# EAGLE design weatherstation (EAGLE 9.5.1)
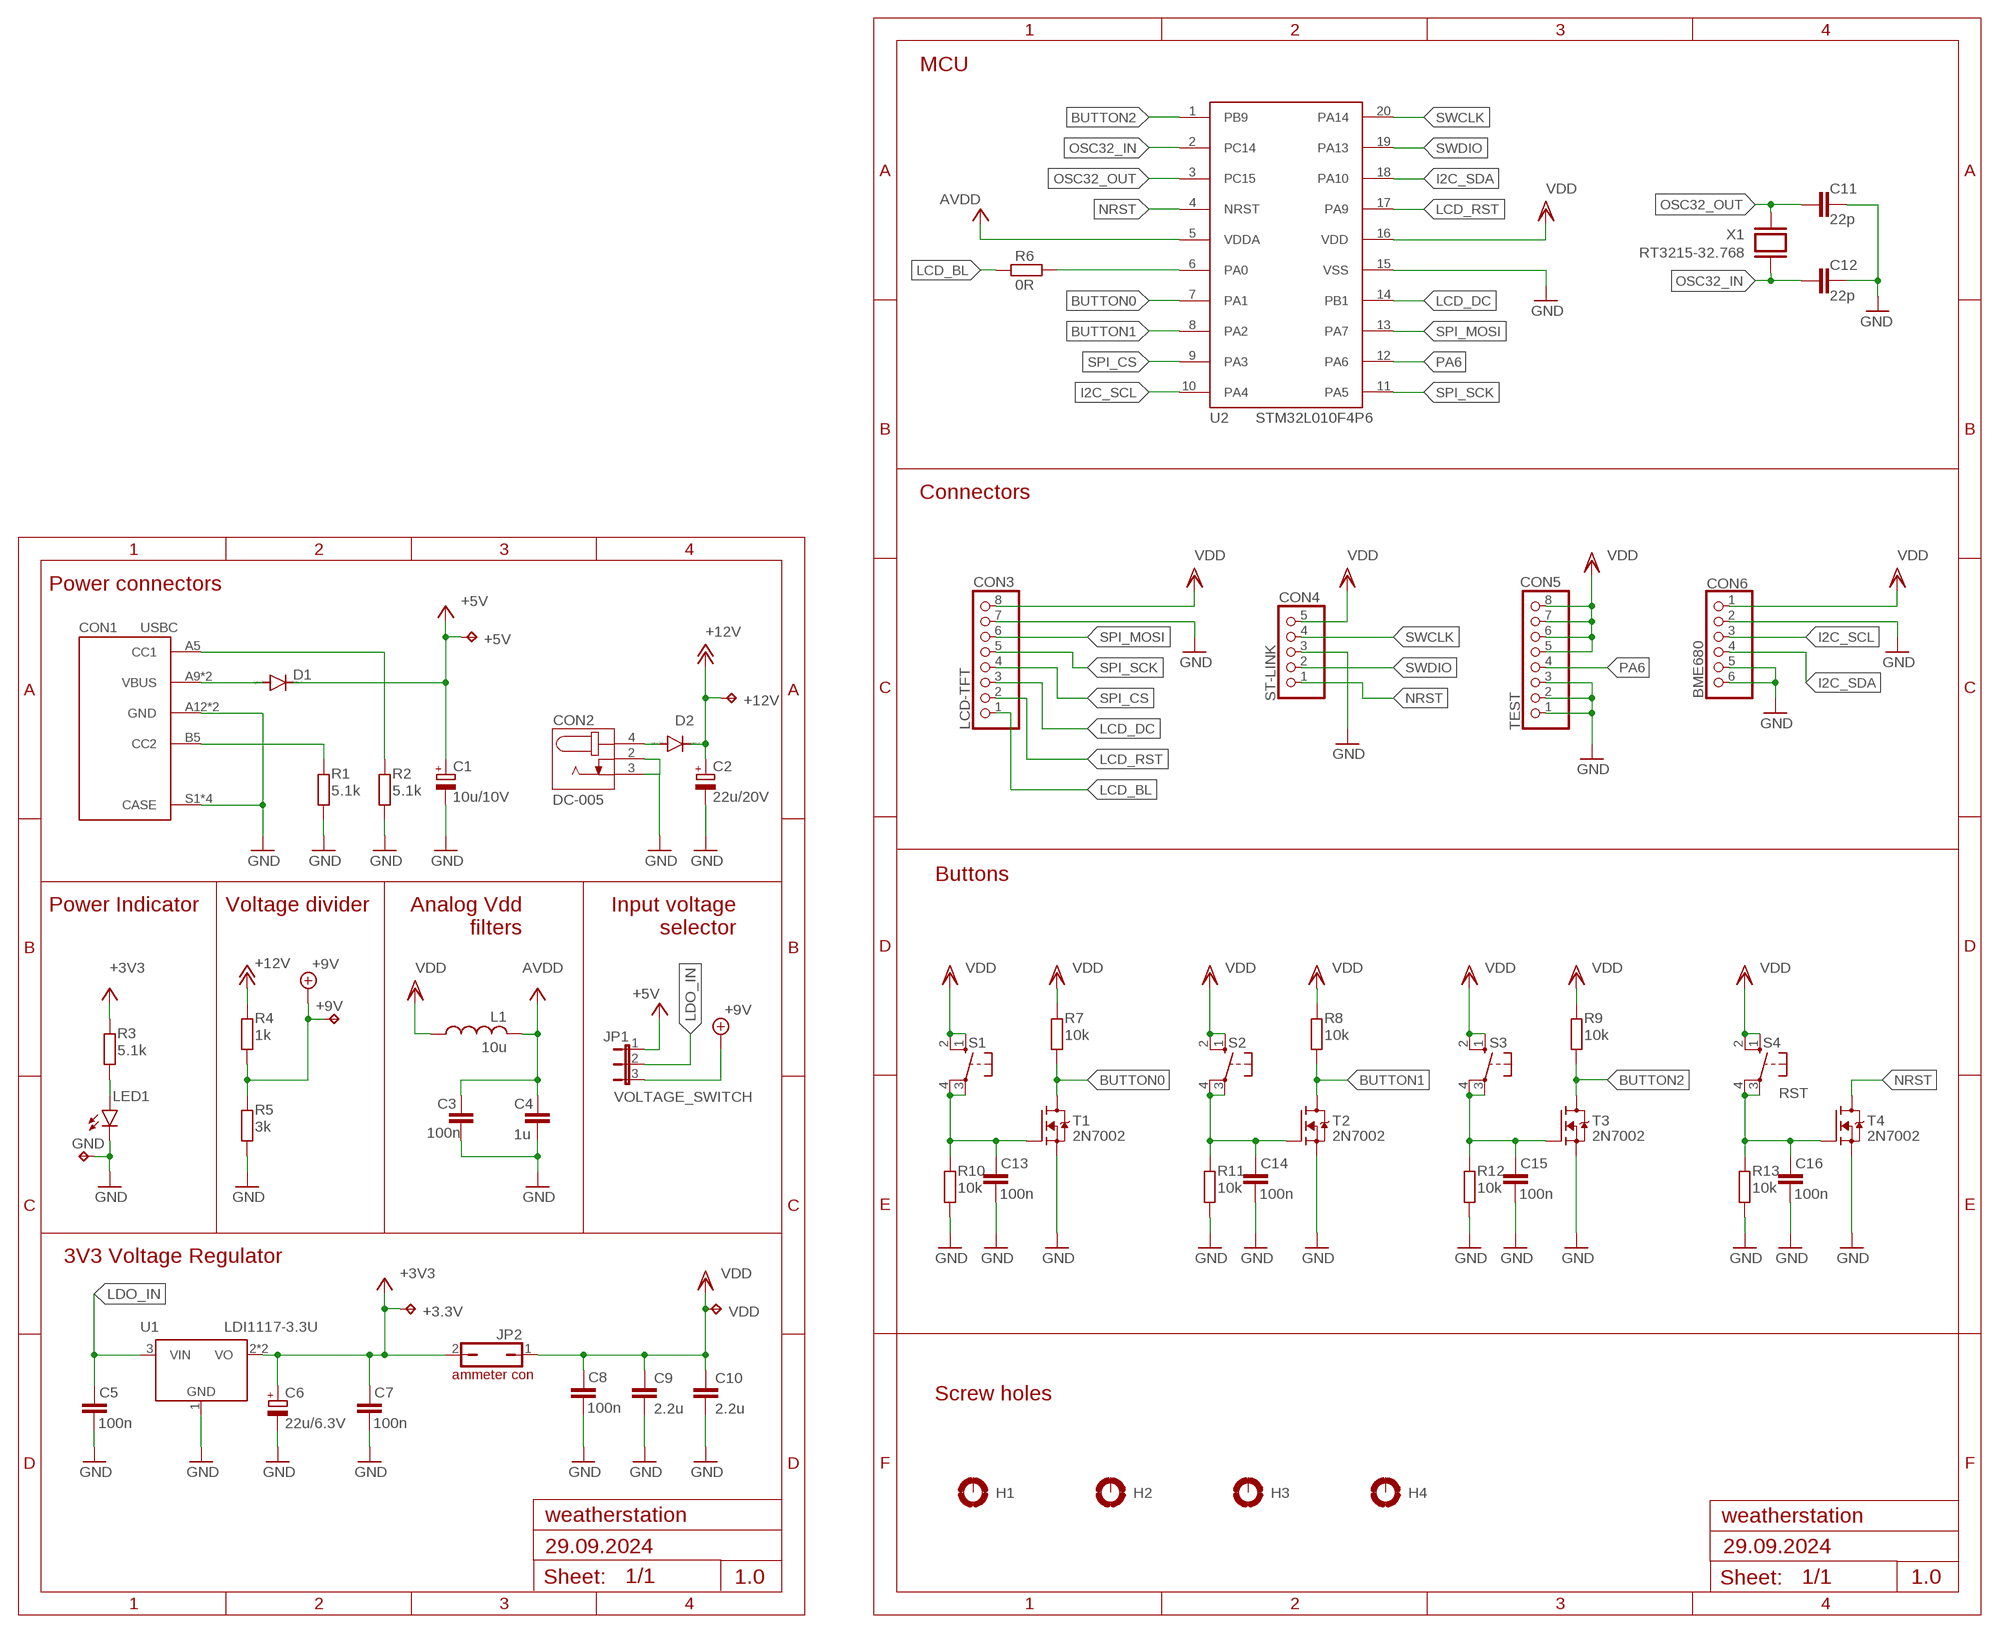
[diagram p0: schematic, sheet 1]

## Parts
+3.3V  TPPAD1-13  [P1-13]
+5V  TPPAD1-13  [P1-13]
+9V  TPPAD1-13  [P1-13]
+12V  TPPAD1-13  [P1-13]
C1  10u/10V  CPOL-EUA/3216-18R  [A/3216-18R]
C2  22u/20V  CPOL-EUC/6032-28R  [C/6032-28R]
C3  100n  C-EUC0603K  [C0603K]
C4  1u  C-EUC0603K  [C0603K]
C5  100n  C-EUC0603K  [C0603K]
C6  22u/6.3V  CPOL-EUA/3216-18R  [A/3216-18R]
C7  100n  C-EUC0603K  [C0603K]
C8  100n  C-EUC0603K  [C0603K]
C9  2.2u  C-EUC0805  [C0805]
C10  2.2u  C-EUC0805  [C0805]
C11  22p  C-EUC0603K  [C0603K]
C12  22p  C-EUC0603K  [C0603K]
C13  100n  C-EUC0603K  [C0603K]
C14  100n  C-EUC0603K  [C0603K]
C15  100n  C-EUC0603K  [C0603K]
C16  100n  C-EUC0603K  [C0603K]
CON1  USBC  [CUI_UJC-HP-3-SMT-TR]
CON2  DC-005  [NINIGI_DC-005]
CON3  LCD-TFT  [LCD]
CON4  ST-LINK  PINHD-1X5  [1X05]
CON5  TEST  PINHD-1X8  [1X08]
CON6  BME680  [BME680]
D1  CGRM4001-G  [SOD-123_MINI-SMA]
D2  ES2D  [SMB]
GND  TPPAD1-13  [P1-13]
H1  MOUNT-PAD-ROUND2.8  [2,8-PAD]
H2  MOUNT-PAD-ROUND2.8  [2,8-PAD]
H3  MOUNT-PAD-ROUND2.8  [2,8-PAD]
H4  MOUNT-PAD-ROUND2.8  [2,8-PAD]
JP1  VOLTAGE_SWITCH  [JP2]
JP2  JP1Q  [JP1]
L1  10u  L-USL2012C  [L2012C]
LED1  LEDCHIPLED_1206  [CHIPLED_1206]
R1  5.1k  R-EU_R0805  [R0805]
R2  5.1k  R-EU_R0805  [R0805]
R3  5.1k  R-EU_R0805  [R0805]
R4  1k  R-EU_R0805  [R0805]
R5  3k  R-EU_R0805  [R0805]
R6  0R  R-EU_R0805  [R0805]
R7  10k  R-EU_R0805  [R0805]
R8  10k  R-EU_R0805  [R0805]
R9  10k  R-EU_R0805  [R0805]
R10  10k  R-EU_R0805  [R0805]
R11  10k  R-EU_R0805  [R0805]
R12  10k  R-EU_R0805  [R0805]
R13  10k  R-EU_R0805  [R0805]
S1  BUTTON0  10-XX  [B3F-10XX]
S2  BUTTON1  10-XX  [B3F-10XX]
S3  BUTTON2  10-XX  [B3F-10XX]
S4  RST  10-XX  [B3F-10XX]
T1  2N7002  [SOT95P240X111-3N]
T2  2N7002  [SOT95P240X111-3N]
T3  2N7002  [SOT95P240X111-3N]
T4  2N7002  [SOT95P240X111-3N]
U1  LDI1117-3.3U  [SOT89]
U2  STM32L010F4P6  [TSSOP20]
VDD  TPPAD1-13  [P1-13]
X1  RT3215-32.768  [XTAL_RT3215-32.768-12.5-TR]

## Nets
+3V3: +3.3V.TP C6.+ C7.1 JP2.2 R3.2 U1.2(VO) U1.2@1(VO)
+5V: +5V.TP C1.+ D1.C JP1.1
+9V: +9V.TP JP1.3 R4.2 R5.1
+12V: +12V.TP C2.+ D2.C R4.1
BUTTON0: R7.1 T1.3(D) U2.7(PA1)
BUTTON1: R8.1 T2.3(D) U2.8(PA2)
BUTTON2: R9.1 T3.3(D) U2.1(PB9)
GND: C1.- C2.- C3.1 C4.2 C5.2 C6.- C7.2 C8.2 C9.2 C10.2 C11.1 C12.1 C13.2 C14.2 C15.2 C16.2 CON1.A12(GND) CON1.B12(GND) CON1.S1(CASE) CON1.S2(CASE) CON1.S3(CASE) CON1.S4(CASE) CON2.2 CON2.3 CON3.7(GND) CON4.3 CON5.1 CON5.2 CON5.3 CON6.2(GND) CON6.5(SDO) CON6.6(CS) GND.TP LED1.C R1.2 R2.1 R5.2 R10.1 R11.1 R12.1 R13.1 T1.2(S) T2.2(S) T3.2(S) T4.2(S) U1.1(GND) U2.15(VSS)
I2C_SCL: CON6.3(SCL) U2.10(PA4)
I2C_SDA: CON6.4(SDA) U2.18(PA10)
LCD_BL: CON3.1(BL) R6.1
LCD_DC: CON3.3(DC) U2.14(PB1)
LCD_RST: CON3.2(RST) U2.17(PA9)
LDO_IN: C5.1 JP1.2 U1.3(VIN)
N$1: LED1.A R3.1
N$2: C16.1 R13.2 S4.3(P) S4.4(P1) T4.1(G)
N$3: CON1.B5(CC2) R1.1
N$4: C13.1 R10.2 S1.3(P) S1.4(P1) T1.1(G)
N$5: CON1.A5(CC1) R2.2
N$6: C14.1 R11.2 S2.3(P) S2.4(P1) T2.1(G)
N$7: R6.2 U2.6(PA0)
N$8: C15.1 R12.2 S3.3(P) S3.4(P1) T3.1(G)
N$9: CON1.A9(VBUS) CON1.B9(VBUS) D1.A
N$10: CON2.4 D2.A
NRST: CON4.1 T4.3(D) U2.4(NRST)
OSC32_IN: C12.2 U2.2(PC14) X1.2
OSC32_OUT: C11.2 U2.3(PC15) X1.1
PA6: CON5.4 U2.12(PA6)
SPI_CS: CON3.4(CS) U2.9(PA3)
SPI_MOSI: CON3.6(DIN) U2.13(PA7)
SPI_SCK: CON3.5(CLK) U2.11(PA5)
SWCLK: CON4.4 U2.20(PA14)
SWDIO: CON4.2 U2.19(PA13)
VCC: C3.2 C4.1 L1.2 U2.5(VDDA) ; supply symbol labelled AVDD
VDD: C8.1 C9.1 C10.1 CON3.8(VCC) CON4.5 CON5.5 CON5.6 CON5.7 CON5.8 CON6.1(VCC) JP2.1 L1.1 R7.2 R8.2 R9.2 S1.1(S) S1.2(S1) S2.1(S) S2.2(S1) S3.1(S) S3.2(S1) S4.1(S) S4.2(S1) U2.16(VDD) VDD.TP
Unconnected: H1.B2,8(MOUNT) H2.B2,8(MOUNT) H3.B2,8(MOUNT) H4.B2,8(MOUNT)

## Notes on the sheet
- MCU
- Connectors
- Power connectors
- Buttons
- Voltage divider
- Analog Vdd
  filters
- Input voltage
  selector
- Power Indicator
- 3V3 Voltage Regulator
- ammeter con
- Screw holes
- 29.09.2024 | 29.09.2024
- 1.0 | 1.0

## Library data of the parts
+3.3V +5V +9V +12V GND VDD = testpad:TP: Test pad
C1 C2 C6 = rcl:CPOL-EU: POLARIZED CAPACITOR, European symbol; SPICEPREFIX: C
C3-C5 C7-C16 = rcl:C-EU: CAPACITOR, European symbol; SPICEPREFIX: C
CON1 = WeatherStation:USBC
CON2 = DC-005:DC-005: DC Jack Check availability <https://pricing.snapeda.com/parts/DC-005/Best%20Inc./view-part?ref=eda>; AVAILABILITY: Not in stock; CHECK_PRICES: https://www.snapeda.com/parts/DC-005/Best+Inc./view-part/?ref=eda; DESCRIPTION: 6.4x14.2x9.0mm Power DC Receptacle; MF: Best Inc.; MP: DC-005; PACKAGE: DC Power Jack Best Inc.; PRICE: None; SNAPEDA_LINK: https://www.snapeda.com/parts/DC-005/Best+Inc./view-part/?ref=snap
CON3 = WeatherStation:LCD-TFT
CON4 = pinhead:PINHD-1X5: PIN HEADER
CON5 = pinhead:PINHD-1X8: PIN HEADER
CON6 = WeatherStation:BME680
D1 = diode:CGRM400*-G: Molded plasitc,JEDEC SOD-123/Mini SMA Source: Comchip CGRM4001-G.pdf
D2 = diode:ES2D: DIODE super fast rectifier, 2 A
H1-H4 = holes:MOUNT-PAD-ROUND: MOUNTING PAD, round
JP1 = WeatherStation:VOLTAGE_SWITCH
JP2 = jumper:JP1Q: JUMPER
L1 = rcl:L-US: INDUCTOR, American symbol; SPICEPREFIX: L
LED1 = led:LED: LED OSRAM: - CHIPLED LG R971, LG N971, LY N971, LG Q971, LY Q971, LO R971, LY R971 LH N974, LH R974 LS Q976, LO Q976, LY Q976 LO Q996 - Hyper CHIPLED LW Q18S LB Q993, LB Q99A, LB R99A - SideLED LS A670, LO A670, LY A670, LG A670, LP A670 LB A673, LV A673, LT A673, LW A673 LH A674 LY A675 LS A676, LA A676, LO A676, LY A676, LW A676 LS A679, LY A679, LG A679 - Hyper Micro SIDELED® LS Y876, LA Y876, LO Y876, LY Y876 LT Y87S - SmartLED LW L88C, LW L88S LB L89C, LB L89S, LG L890 LS L89K, LO L89K, LY L89K LS L896, LA L896, LO L896, LY L896 - TOPLED LS T670, LO T670, LY T670, LG T670, LP T670 LSG T670, LSP T670, LSY T670, LOP T670, LYG T670 LG T671, LOG T671, LSG T671 LB T673, LV T673, LT T673, LW T673 LH T674 LS T676, LA T676, LO T676, LY T676, LB T676, LH T676, LSB T676, LW T676 LB T67C, LV T67C, LT T67C, LS T67K, LO T67K, LY T67K, LW E67C LS E67B, LA E67B, LO E67B, LY E67B, LB E67C, LV E67C, LT E67C LW T67C LS T679, LY T679, LG T679 LS T770, LO T770, LY T770, LG T770, LP T770 LB T773, LV T773, LT T773, LW T773 LH T774 LS E675, LA E675, LY E675, LS T675 LS T776, LA T776, LO T776, LY T776, LB T776 LHGB T686 LT T68C, LB T68C - Hyper Mini TOPLED® LB M676 - Mini TOPLED Santana® LG M470 LS M47K, LO M47K, LY M47K Source: http://www.osram.convergy.de LUXEON: - LUMILED® LXK2-PW12-R00, LXK2-PW12-S00, LXK2-PW14-U00, LXK2-PW14-V00 LXK2-PM12-R00, LXK2-PM12-S00, LXK2-PM14-U00 LXK2-PE12-Q00, LXK2-PE12-R00, LXK2-PE12-S00, LXK2-PE14-T00, LXK2-PE14-U00 LXK2-PB12-K00, LXK2-PB12-L00, LXK2-PB12-M00, LXK2-PB14-N00, LXK2-PB14-P00, LXK2-PB14-Q00 LXK2-PR12-L00, LXK2-PR12-M00, LXK2-PR14-Q00, LXK2-PR14-R00 LXK2-PD12-Q00, LXK2-PD12-R00, LXK2-PD12-S00 LXK2-PH12-R00, LXK2-PH12-S00 LXK2-PL12-P00, LXK2-PL12-Q00, LXK2-PL12-R00 Source: www.luxeon.com KINGBRIGHT: KA-3528ASYC Source: www.kingbright.com
R1-R13 = rcl:R-EU_: RESISTOR, European symbol; SPICEPREFIX: R
S1-S4 = switch-omron:10-XX: OMRON SWITCH; MPN: B3F-1000; OC_FARNELL: 176432; OC_NEWARK: 36M3542
T1-T4 = WeatherStation:2N7002
U1 = WeatherStation:LDI1117-3.3U
U2 = WeatherStation:STM32L010F4P6
X1 = WeatherStation:RT3215-32.768

## Board
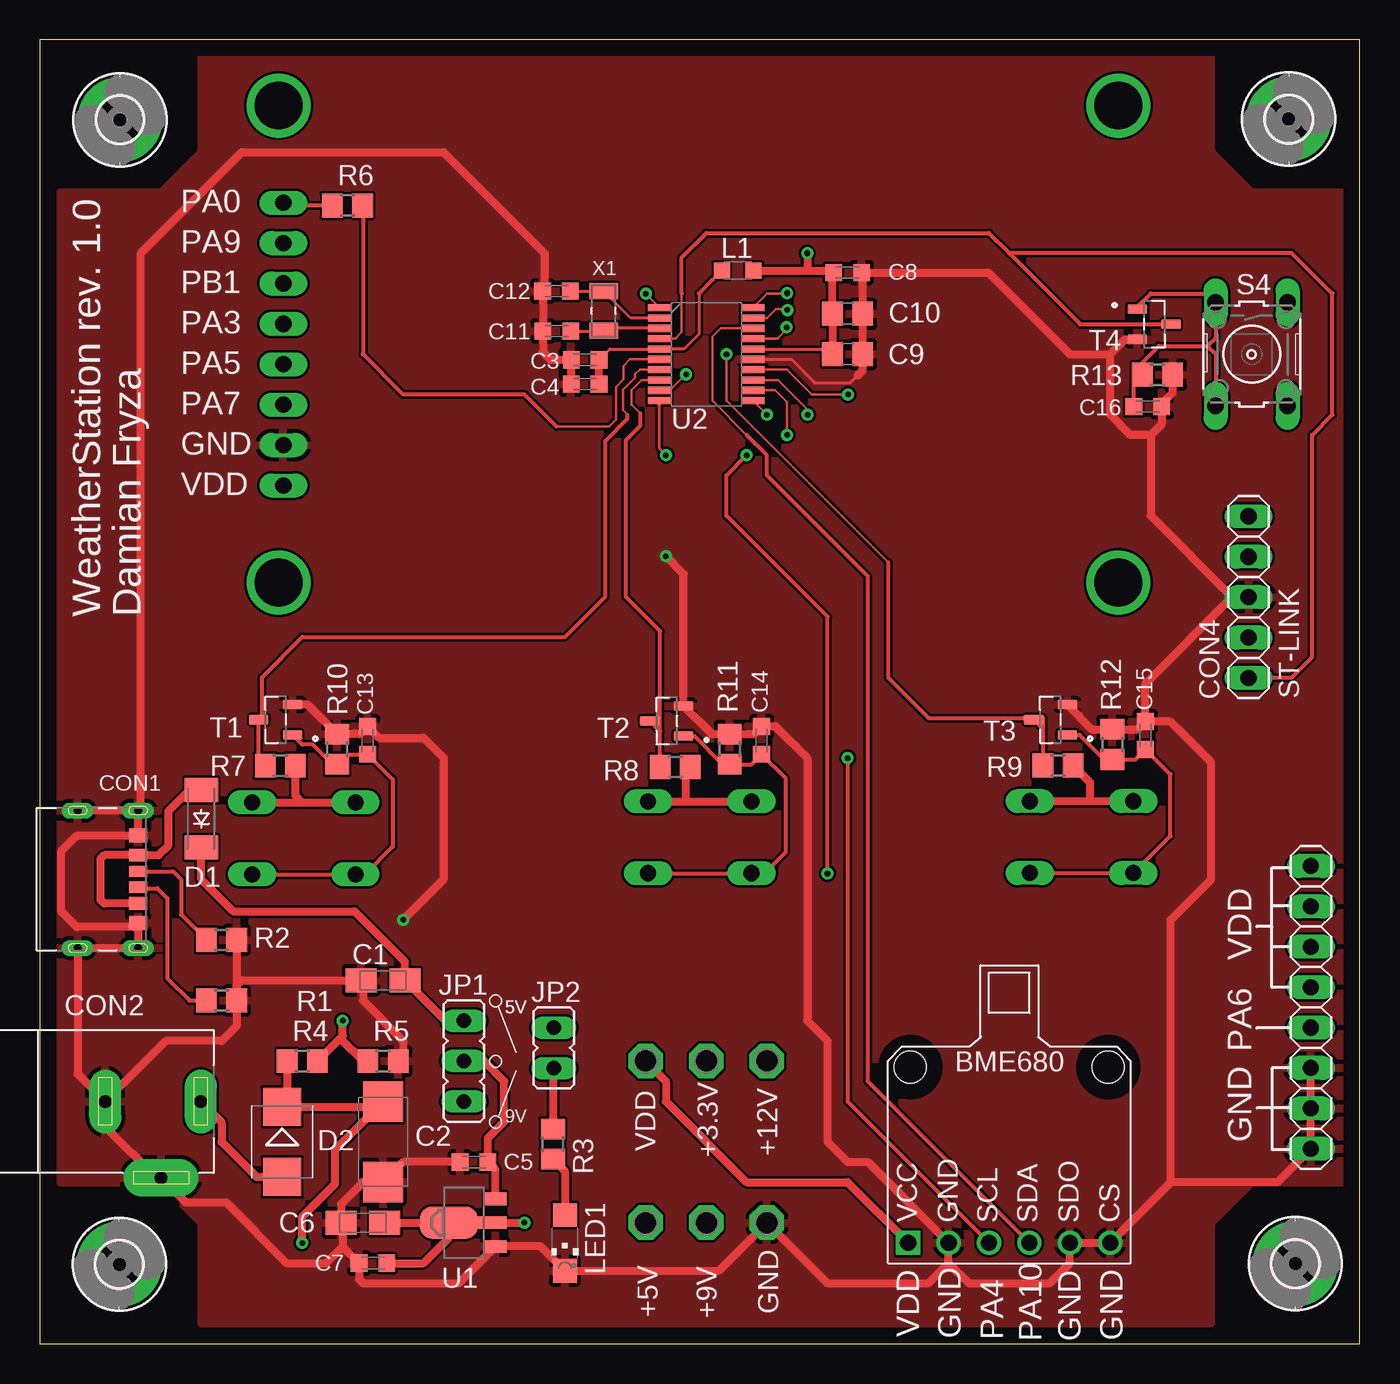
[diagram p1: board, top side]
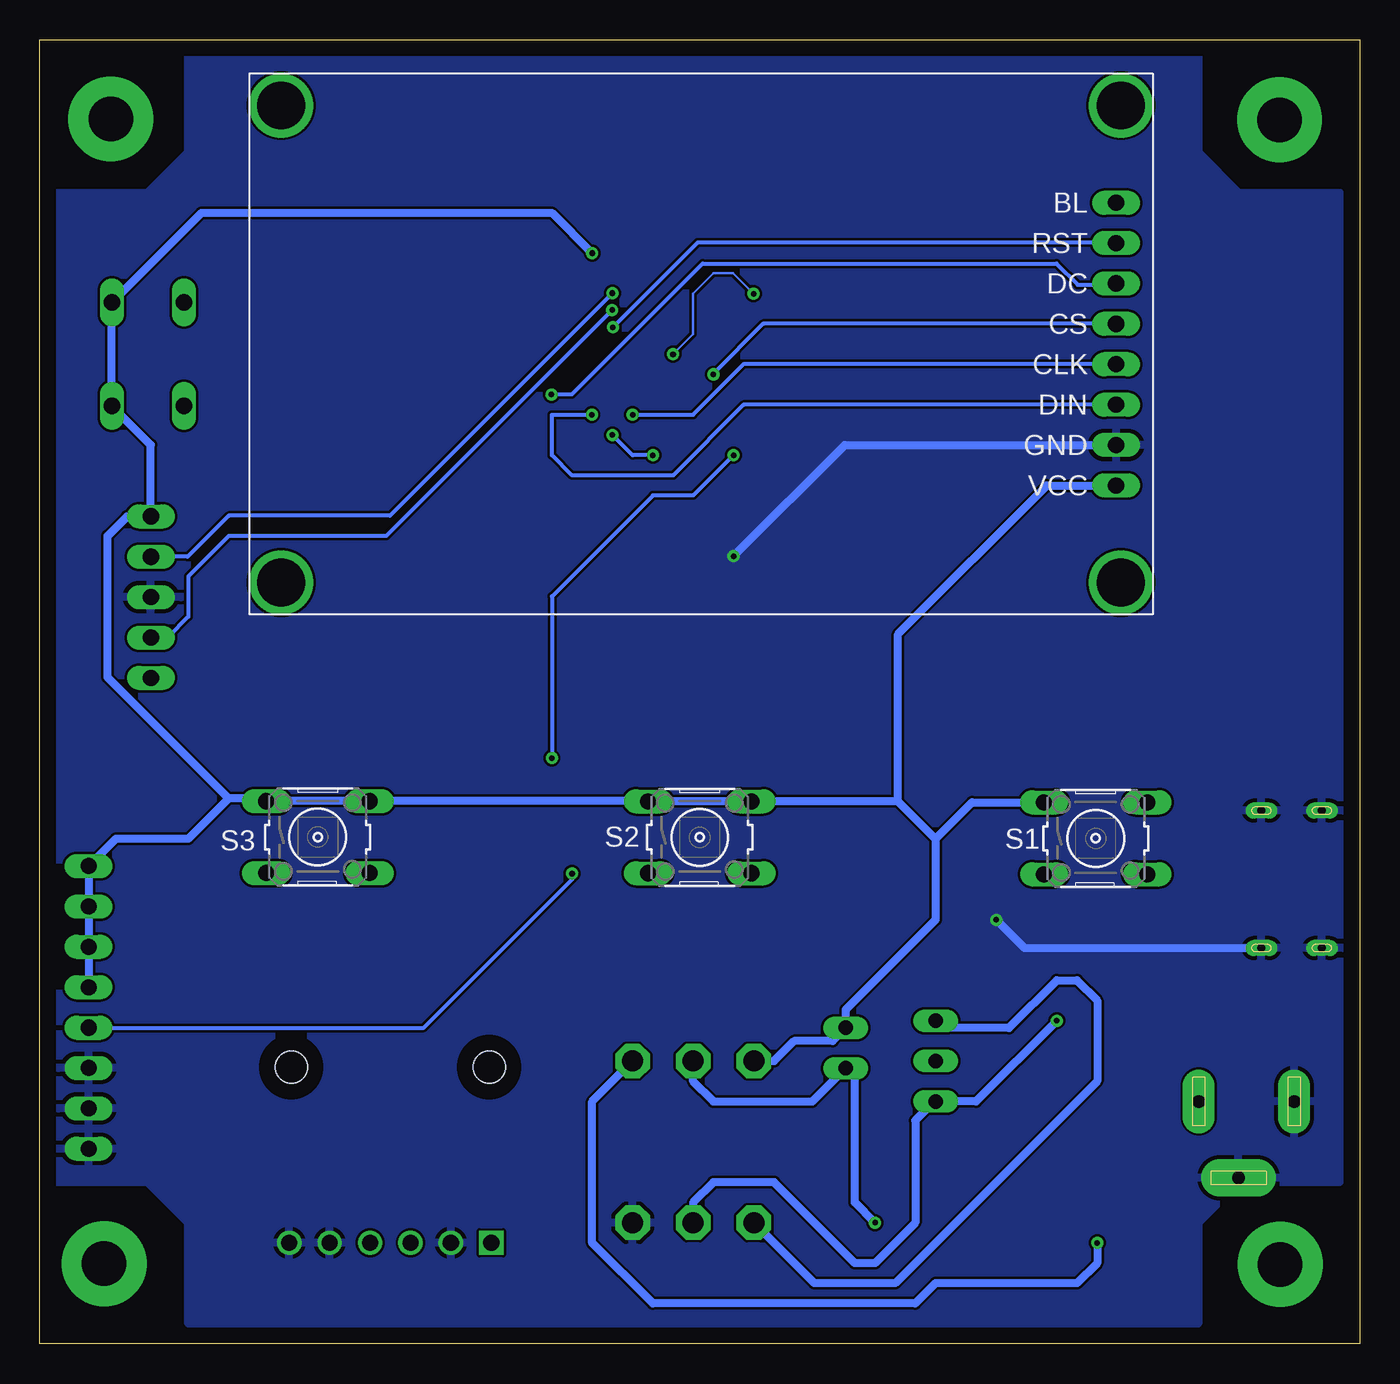
[diagram p2: board, bottom side, seen from below]

Size 83 x 82 mm. Coordinates in mm from the lower left corner, seen from the top.
Outline: 0,0 83,0 83,82 0,82 0,0
Copper layers (1*16): Top 0.035mm / dielectric 0.15mm / Bottom 0.035mm
Design rules "default": minimum track width 6mil, minimum drill 0.35mm, track to track 6mil, track to pad 6mil, pad to pad 6mil, via to via 6mil, smd to smd 6mil, copper to edge 40mil, drill to drill 6mil, minimum pad ring 10mil, minimum via ring 8mil, stop-mask expansion 4mil, vias tented up to drill 0mil, thermal gap 10mil

### Footprints (pad centres in the part's own frame; a part is rotated, then mirrored left to right if it is on the bottom)
P1-13 = drill 1.321 pad 2.159 octagon: TP 0,0
A/3216-18R = smd 1.95 x 1.5: + 1.375,0; - -1.375,0
C/6032-28R = smd 2.55 x 2.5: + 2.525,0; - -2.525,0
C0603K = smd 1.05 x 1.08: 1 -0.875,0; 2 0.875,0
C0805 = smd 1.3 x 1.5: 1 -0.95,0; 2 0.95,0
CUI_UJC-HP-3-SMT-TR = smd 0.7 x 1.15: A5 -0.5,0.005; B5 0.5,0.005 | smd 0.8 x 1.15: A9 1.52,0.005; B9 -1.52,0.005 | smd 0.9 x 1.15: A12 2.75,0.005; B12 -2.75,0.005 | drill 0.5 pad 1 long: S1 -4.32,0; S2 4.32,0; S3 -4.32,-3.8; S4 4.32,-3.8
NINIGI_DC-005 = drill 0.8 pad 2.35 long: 2 0,-4.8 | drill 0.8 pad 2 long: 3 -3.5,0; 4 2.5,0
LCD = drill 1.016 long: 1 0,8.89; 2 0,6.35; 3 0,3.81; 4 0,1.27; 5 0,-1.27; 6 0,-3.81; 7 0,-6.35; 8 0,-8.89 | drill 3 pad 4: G1 0.3,-15; G2 -52.5,-15; G3 -52.5,15; G4 0.3,15
1X05 = drill 1.016 long: 1 -5.08,0; 2 -2.54,0; 3 0,0; 4 2.54,0; 5 5.08,0
1X08 = drill 1.016 long: 1 -8.89,0; 2 -6.35,0; 3 -3.81,0; 4 -1.27,0; 5 1.27,0; 6 3.81,0; 7 6.35,0; 8 8.89,0
BME680 = drill 1.016 square: 1 -6.35,0 | drill 1.016: 2 -3.81,0; 3 -1.27,0; 4 1.27,0; 5 3.81,0; 6 6.35,0 | hole 2: -6.223,11.049; 6.223,11.049
SOD-123_MINI-SMA = smd 1.5 x 2.1: A 1.8,0; C -1.8,0
SMB = smd 2.4 x 2.4: A 2.2,0; C -2.2,0
2,8-PAD = drill 2.8 pad 5.334: B2,8 0,0
JP2 = drill 0.914 long: 1 -2.54,0; 2 0,0; 3 2.54,0
JP1 = drill 0.914 long: 1 0,-1.27; 2 0,1.27
L2012C = smd 1 x 1: 1 -1,0; 2 1,0
CHIPLED_1206 = smd 1.5 x 1.5: A 0,-1.75; C 0,1.75
R0805 = smd 1.3 x 1.5: 1 -0.95,0; 2 0.95,0
B3F-10XX = drill 1.016 long: 1 -3.251,2.261; 2 3.251,2.261; 3 -3.251,-2.261; 4 3.251,-2.261
SOT95P240X111-3N = smd 1.23 x 0.6: 1 -1.06,0.95; 2 -1.06,-0.95; 3 1.06,0
SOT89 = smd 0.8 x 1.4: 1 -1.499,-1.981; 3 1.499,-1.981 | smd 0.8 x 1.9: 2 0,-1.727 | smd 2.032 x 3.65: 2@1 0,0.94
TSSOP20 = smd 1.475 x 0.45: 1 -2.938,2.925; 2 -2.938,2.275; 3 -2.938,1.625; 4 -2.938,0.975; 5 -2.938,0.325; 6 -2.938,-0.325; 7 -2.938,-0.975; 8 -2.938,-1.625; 9 -2.938,-2.275; 10 -2.938,-2.925; 11 2.938,-2.925; 12 2.938,-2.275; 13 2.938,-1.625; 14 2.938,-0.975; 15 2.938,-0.325; 16 2.938,0.325; 17 2.938,0.975; 18 2.938,1.625; 19 2.938,2.275; 20 2.938,2.925
XTAL_RT3215-32.768-12.5-TR = smd 1 x 1.8: 1 -1.25,0; 2 1.25,0

### Placement (x,y rotation side)
+3.3V  41.91,17.78 90 top
+5V  38.1,7.62 90 top
+9V  41.91,7.62 90 top
+12V  45.72,17.78 90 top
C1  21.59,22.86 0 top
C2  21.59,12.7 90 top
C3  34.29,61.87 0 top
C4  34.29,60.35 180 top
C5  27.3,11.43 180 top
C6  20.32,7.62 0 top
C7  20.95,5.08 180 top
C8  50.8,67.36 0 top
C9  50.8,62.23 0 top
C10  50.8,64.77 0 top
C11  32.51,63.68 0 top
C12  32.49,66.19 0 top
C13  20.62,37.95 90 top
C14  45.39,37.95 90 top
C15  69.52,38.25 90 top
C16  69.67,58.93 0 top
CON1  6.18,29.21 270 top
CON2  7.62,15.24 0 top
CON3  15.32,62.87 0 bottom
CON4  76.01,46.95 90 top
CON5  79.93,21.15 90 top
CON6  60.96,6.35 0 top
D1  10.16,33.02 90 top
D2  15.24,12.7 270 top
GND  45.72,7.62 90 top
H1  5,5 180 top
H2  78.95,5.04 180 top
H3  5.04,76.96 180 top
H4  78.53,77.02 0 top
JP1  26.67,17.78 270 top
JP2  32.33,18.61 180 top
L1  43.89,67.49 180 top
LED1  33.02,6.35 180 top
R1  11.43,21.59 0 top
R2  11.43,25.4 180 top
R3  32.27,12.56 90 top
R4  16.51,17.78 0 top
R5  21.59,17.78 0 top
R6  19.35,71.58 0 top
R7  15.13,36.35 0 top
R8  39.96,36.28 0 top
R9  64.03,36.36 0 top
R10  18.69,37.39 270 top
R11  43.38,37.39 270 top
R12  67.44,37.69 270 top
R13  70.28,60.93 180 top
S1  16.6,31.78 0 bottom
S2  41.5,31.85 0 bottom
S3  65.51,31.86 0 bottom
S4  76.2,62.23 270 top
T1  14.83,39.24 180 top
T2  39.42,39.17 180 top
T3  63.55,39.24 180 top
T4  70.08,64.11 0 top
U1  26.67,7.62 90 top
U2  41.91,62.23 0 top
VDD  38.1,17.78 90 top
X1  35.46,64.95 90 top

### Tracks (layer width: path | path; a pad name or v marks a point on that pad's centre or on a via)
+3V3  (via drill 0.35)
  Top 0.508: JP2.2 32.27,17.27 R3.2 | 21.83,7.49 C6.+ U1.2@1 | U1.2@1 U1.2 v30.48,7.62 | C7.1 24.13,5.08 25.73,6.68 U1.2@1
  Bottom 0.508: v30.48,7.62 31.75,8.89 31.75,16.76 JP2.2 34.42,15.24 40.64,15.24 41.91,16.51 +3.3V.TP
+5V
  Top 0.508: JP1.1 25.5,20.32 C1.+ 22.96,24.02 19.79,27.2 12.17,27.2 10.16,29.21 D1.C
  Bottom 0.508: +5V.TP 34.29,3.81 29.21,3.81 16.51,16.51 16.51,21.59 17.78,22.86 19.05,22.86 22.05,19.86 26.21,19.86 JP1.1
+9V  (via drill 0.35)
  Top 0.508: R4.2 18.89,19.21 | 18.89,19.21 19.05,19.37 v19.05,20.32 | 18.89,19.21 20.32,17.78 R5.1
  Bottom 0.508: v19.05,20.32 24.13,15.24 JP1.3 26.75,15.24 27.94,14.05 27.94,7.62 30.48,5.08 31.75,5.08 36.83,10.16 40.64,10.16 41.91,8.89 +9V.TP
+12V  (via drill 0.35)
  Top 0.508: R4.1 15.56,15.22 D2.C 21.27,14.9 C2.+ 18.57,12.2 18.57,10.06 16.51,8 v16.51,6.35
  Bottom 0.508: +12V.TP 48.26,15.24 48.26,6.35 44.45,2.54 27.94,2.54 26.67,3.81 17.78,3.81 16.51,5.08 v16.51,6.35
BUTTON0
  Top 0.152: 36.96,58.42 36.68,58.7 36.68,59.99 37.44,60.76 37.44,60.96 37.73,61.26 U2.7
  Top 0.254: 36.96,58.42 36.96,58.17 35.56,56.77 35.56,46.99 33.02,44.45 16.51,44.45 13.97,41.91 13.97,39.44 T1.3 13.77,36.76 R7.1
BUTTON1
  Top 0.152: 37.77,58.5 37.21,59.05 37.21,59.97 37.85,60.6 U2.8
  Top 0.254: 37.77,58.5 37.77,57.73 36.85,56.82 36.85,46.97 39.01,44.81 39.01,38.52 | R8.1 39.01,38.52 | 39.01,38.52 T2.3
BUTTON2  (via drill 0.35)
  Top 0.152: 53.34,49.15 43.18,59.31 v43.18,62.23 | U2.1 38.11,66.01 v38.11,66.03
  Top 0.254: 53.34,49.15 53.34,41.91 55.88,39.37 63.08,39.37 63.08,38.65 | T3.3 63.08,38.65 | 63.08,38.65 R9.1
  Bottom 0.152: v43.18,62.23 41.91,63.5 41.91,66.04 40.64,67.31 39.4,67.31 v38.11,66.03
GND  (via drill 0.35)
  Top 0.203: U2.15 47.26,61.91 48.72,60.45 50.98,60.45 51.44,60.91
  Top 0.508: CON1.S1 CON1.S3 | C12.1 31.64,66.17 | 31.64,66.17 C11.1 31.64,62.34 32.11,61.87 C3.1 C4.2 | 51.44,60.91 51.75,61.22 C9.2 C10.2 51.75,67.29 C8.2 59.64,67.36 64.77,62.23 67.31,62.23 | T1.2 16.84,40.19 R10.1 20.14,38.34 C13.2 21.35,38.1 24.13,38.1 25.4,36.83 25.4,29.21 v22.86,26.67 | T3.2 66.16,38.64 R12.1 69.04,38.64 C15.2 | R13.1 71.23,59.8 70.55,59.12 C16.2 70.55,57.85 69.85,57.15 | T4.2 68.24,63.16 67.31,62.23 | 69.85,57.15 68.58,57.15 67.31,58.42 67.31,62.23 | v39.37,49.53 40.48,48.42 T2.2 42.26,38.34 R11.1 44.91,38.34 C14.2 46.27,38.82 48.26,36.83 48.26,20.32 49.53,19.05 49.53,12.7 50.8,11.43 52.07,11.43 CON6.2 57.15,5.08 | CON2.3 2.38,16.98 CON1.S4 CON1.S2 CON1.A12 5.94,26.21 2.33,26.21 1.36,27.18 1.36,30.99 2.33,31.96 CON1.B12 CON1.S1 | R2.1 R1.2 | R1.2 12.38,22.54 12.7,22.86 C1.- 20.32,22.75 20.32,21.59 22.86,19.05 22.86,17.78 R5.2 | 57.15,5.08 55.88,3.81 49.53,3.81 GND.TP 42.7,4.6 LED1.C 31.5,6.12 U1.1 26.34,3.81 20.32,3.81 20.08,4.05 C7.2 19.05,6.11 | 57.15,5.08 58.42,3.81 63.5,3.81 64.77,5.08 CON6.5 CON6.6 71.12,10.16 | 71.12,10.16 77.83,10.16 CON5.1 CON5.2 CON5.3 | 69.85,57.15 69.85,52.07 74.97,46.95 | 74.97,46.95 CON4.3 | CON1.S1 6.35,33.7 6.35,68.58 12.7,74.93 25.4,74.93 31.75,68.58 31.75,66.17 31.64,66.17 | 71.12,10.16 71.12,26.67 73.66,29.21 73.66,36.55 71.08,39.13 C15.2 | C15.2 69.52,41.5 74.97,46.95 | CON2.3 4.12,13.66 7.34,10.44 CON2.2 9.17,8.89 11.71,8.89 15.52,5.08 18.02,5.08 19.05,6.11 | C5.2 22.84,11.43 C2.- 21.57,10.16 20.32,10.16 18.95,8.79 C6.- 19.05,7.51 19.05,6.11 | CON2.3 7.93,19.05 11.43,19.05 12.38,20 R1.2
  Bottom 0.508: v39.37,49.53 32.38,56.52 CON3.7 | v22.86,26.67 21.08,24.89 CON1.S2
  pour Top: 1.27,10.16 7.62,10.16 10.16,7.62 10.16,1.27 73.66,1.27 73.66,7.62 76.2,10.16 82.55,10.16 82.55,72.39 76.2,72.39 73.66,74.93 73.66,80.01 73.66,81.28 10.16,81.28 10.16,77.47 10.16,76.2 10.16,74.93 7.62,72.39 1.27,72.39
  pour Bottom: 1.27,10.16 7.62,10.16 10.16,7.62 10.16,1.27 73.66,1.27 73.66,7.62 76.2,10.16 82.55,10.16 82.55,72.39 76.2,72.39 73.66,74.93 73.66,81.28 10.16,81.28 10.16,74.93 7.62,72.39 1.27,72.39
I2C_SCL  (via drill 0.35)
  Top 0.203: v39.37,55.88 38.97,56.28 U2.10
  Top 0.254: v50.8,36.83 50.8,15.24 CON6.3
  Bottom 0.254: v39.37,55.88 41.91,53.34 44.45,53.34 50.8,46.99 v50.8,36.83
I2C_SDA
  Top 0.152: 44.45,57.15 42.29,59.31 42.29,63.32 42.82,63.85 U2.18
  Top 0.254: 44.45,57.15 45.72,55.88 45.72,54.61 52.07,48.26 52.07,16.51 CON6.4
LCD_BL
  Top 0.254: R6.1 15.49,71.58 CON3.1
LCD_DC  (via drill 0.35)
  Top 0.152: U2.14 47,61.26 48.56,59.69 v50.83,59.69
  Bottom 0.254: v50.83,59.69 49.55,59.69 41.31,67.93 19.06,67.93 17.73,66.6 15.39,66.6 CON3.3
LCD_RST  (via drill 0.35)
  Top 0.152: v46.97,63.92 46.97,63.79 46.38,63.2 U2.17
  Bottom 0.254: v46.97,63.92 41.62,69.27 17.78,69.27 17.75,69.27 15.37,69.27 CON3.2
LDO_IN
  Top 0.508: JP1.2 27.94,17.78 29.21,16.51 29.21,13.97 28.18,12.94 C5.1 28.65,10.96 U1.3
N$1
  Top 0.508: R3.1 33.02,10.86 LED1.A
N$2
  Top 0.254: T4.1 69.02,65.21 69.85,66.04 73.38,66.04 S4.3 73.94,63.25 73.43,62.74 | S4.4 73.94,62.23 73.43,62.74 | C16.1 68.8,60.4 R13.2 69.33,61.71 70.36,62.74 73.43,62.74
N$3
  Top 0.254: CON1.B5 6.25,28.65 7.39,28.65 8.03,28.02 8.03,22.99 9.42,21.59 R1.1
N$4
  Top 0.254: T1.1 16.5,37.68 17.16,37.68 18.41,36.44 R10.2 19.33,37.07 C13.1 22.2,35.5 22.2,31.27 20.45,29.52 S1.3 S1.4
N$5
  Top 0.254: CON1.A5 8.39,29.71 8.89,29.21 8.89,26.99 R2.2
N$6
  Top 0.254: T2.1 41.17,38.22 42.95,36.44 R11.2 44.76,36.44 C14.1 46.91,35.55 46.91,30.94 45.57,29.59 S2.3 S2.4
N$7
  Top 0.152: 32.49,57.68 35.79,57.68 36.22,58.12 36.22,60.17 36.7,60.66 36.7,61.49 37.12,61.91 U2.6
  Top 0.254: 32.49,57.68 30.48,59.69 22.86,59.69 20.32,62.23 20.32,71.56 R6.2
N$8
  Top 0.254: T3.1 65.37,38.29 66.92,36.74 R12.2 68.89,36.74 C15.1 71.09,35.8 71.09,31.93 S3.3 S3.4
N$9
  Top 0.508: CON1.A9 4.06,27.69 3.81,27.94 3.81,30.48 4.06,30.73 CON1.B9 7.49,30.73 8.1,31.34 8.1,33.5 9.42,34.82 D1.A
N$10
  Top 0.508: CON2.4 11.43,13.93 11.43,12.7 13.63,10.5 D2.A
NRST
  Top 0.152: U2.4 39.96,63.2 40.36,63.6 40.36,66.04
  Top 0.254: CON4.1 76.05,41.91 78.74,41.91 80.01,43.18 80.01,57.15 81.28,58.42 81.28,66.04 78.74,68.58 60.96,68.58 | 40.36,66.04 40.36,68.3 41.91,69.85 59.69,69.85 60.96,68.58 | T4.3 65.43,64.11 60.96,68.58
OSC32_IN
  Top 0.203: U2.2 37.15,64.5 X1.2 C12.2
OSC32_OUT
  Top 0.203: U2.3 35.62,63.85 X1.1 35.44,63.68 C11.2
PA6  (via drill 0.35)
  Top 0.152: v46.99,57.15 46.99,59.21 46.24,59.95 U2.12
  Top 0.254: v49.53,29.57 49.53,45.72 43.18,52.07 43.18,54.61 v44.45,55.88
  Bottom 0.254: v44.45,55.88 45.72,55.88 v46.99,57.15 | CON5.4 58.86,19.88 49.53,29.21 v49.53,29.57
SPI_CS  (via drill 0.35)
  Top 0.152: U2.9 39.63,59.95 v40.64,60.96
  Bottom 0.254: v40.64,60.96 40.64,61.01 37.52,64.14 CON3.4
SPI_MOSI  (via drill 0.35)
  Top 0.152: U2.13 46.43,60.6 48.28,58.75 v48.28,58.42
  Bottom 0.254: v48.28,58.42 50.8,58.42 50.8,55.88 49.53,54.61 43.18,54.61 38.73,59.05 CON3.6
SPI_SCK  (via drill 0.35)
  Top 0.152: U2.11 45.72,58.43 v45.72,58.42
  Bottom 0.254: v45.72,58.42 41.91,58.42 38.71,61.62 15.34,61.62 CON3.5
SWCLK  (via drill 0.35)
  Top 0.152: v46.99,66.06 46.97,66.04 45.72,66.04 U2.20
  Bottom 0.254: v46.99,66.06 60.98,52.07 71.12,52.07 73.7,49.49 CON4.4
SWDIO  (via drill 0.35)
  Top 0.152: v47,65.01 46.99,65 46.94,65.05 46.28,65.05 45.73,64.5 U2.19
  Bottom 0.254: v47,65.01 61.21,50.8 71.12,50.8 73.66,48.26 73.66,45.72 74.97,44.41 CON4.2
VCC
  Top 0.203: 42.31,66.91 L1.2 | 41.45,66.04 41.45,63.5 40.51,62.55 U2.5 35.85,62.55 C3.2
  Top 0.254: 42.31,66.91 41.45,66.05 41.45,66.04
  Top 0.508: C4.1 C3.2
VDD  (via drill 0.35)
  Top 0.203: U2.16 49.52,62.55 C9.1
  Top 0.508: 49.85,67.29 C8.1 | L1.1 48.26,67.49 | 48.26,67.49 49.65,67.49 49.85,67.29 | S1.2 16.51,34.04 | 16.51,34.04 S1.1 | 16.51,34.04 16.08,34.47 R7.2 | S2.2 40.64,34.11 | 40.64,34.11 S2.1 | 40.64,34.11 40.64,36.01 R8.2 | S3.2 66.04,34.12 | 66.04,34.12 S3.1 | R9.2 66.04,35.3 66.04,34.12 | v48.26,68.58 48.26,67.49 | VDD.TP 39.37,16.51 39.37,15.24 44.45,10.16 50.8,10.16 CON6.1 | 49.85,67.29 C10.1 C9.1
  Bottom 0.508: 26.67,31.75 24.38,34.04 S1.1 | 26.67,31.75 29.03,34.11 | 29.03,34.11 S2.2 S2.1 44.77,34.12 S3.2 S3.1 68.93,34.29 71.12,34.29 | 71.12,34.29 78.74,41.91 78.74,50.8 77.51,52.03 CON4.5 76.01,56.53 S4.2 S4.1 72.82,71.12 50.8,71.12 v48.26,68.58 | 29.03,34.11 29.03,44.63 19.68,53.98 CON3.8 | 26.67,31.75 26.67,26.67 32.33,21.01 JP2.1 33.15,19.05 35.56,19.05 36.83,17.78 VDD.TP | 71.12,34.29 73.66,31.75 78.22,31.75 CON5.8 CON5.7 CON5.6 CON5.5

### Text on the board
tPlace: PA0 | PA9 | PB1 | PA3 | PA5 | PA7 | GND | VDD | WeatherStation rev. 1.0 | Damian Fryza | 5V | 5V | 9V | VDD | GND | PA4 | PA10 | GND | GND
tNames: VDD | PA6 | GND